# Altium schematic sheet number1.SchDoc: Number 1: DMX / RDM Tester
size A2; Date: Aug 31, 2015; DrawnBy: AF; Organization: Openlighting; DocumentName: Number1 - USD / RDM Tester
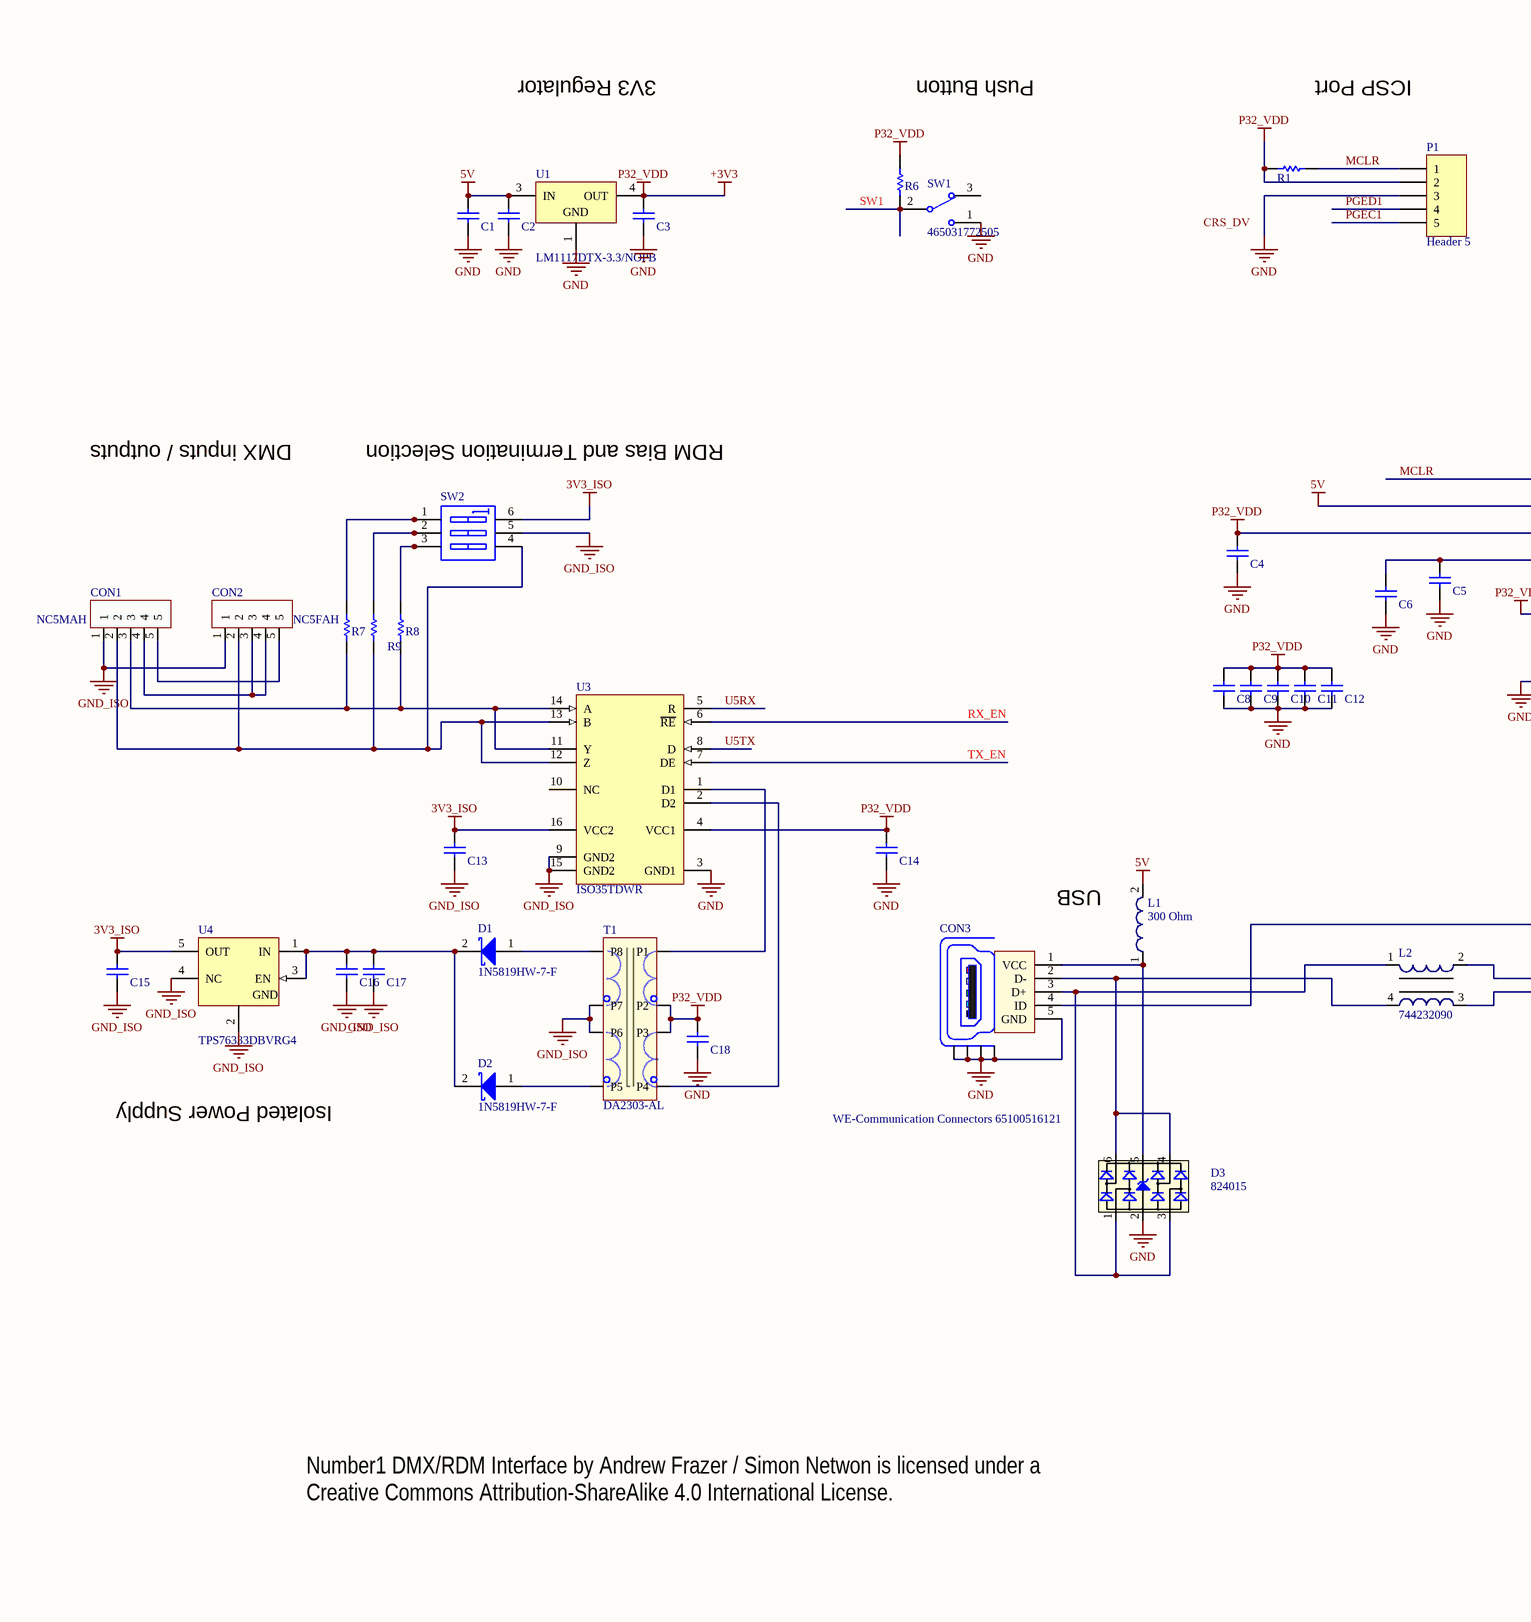
[diagram p0: number1.SchDoc, left]
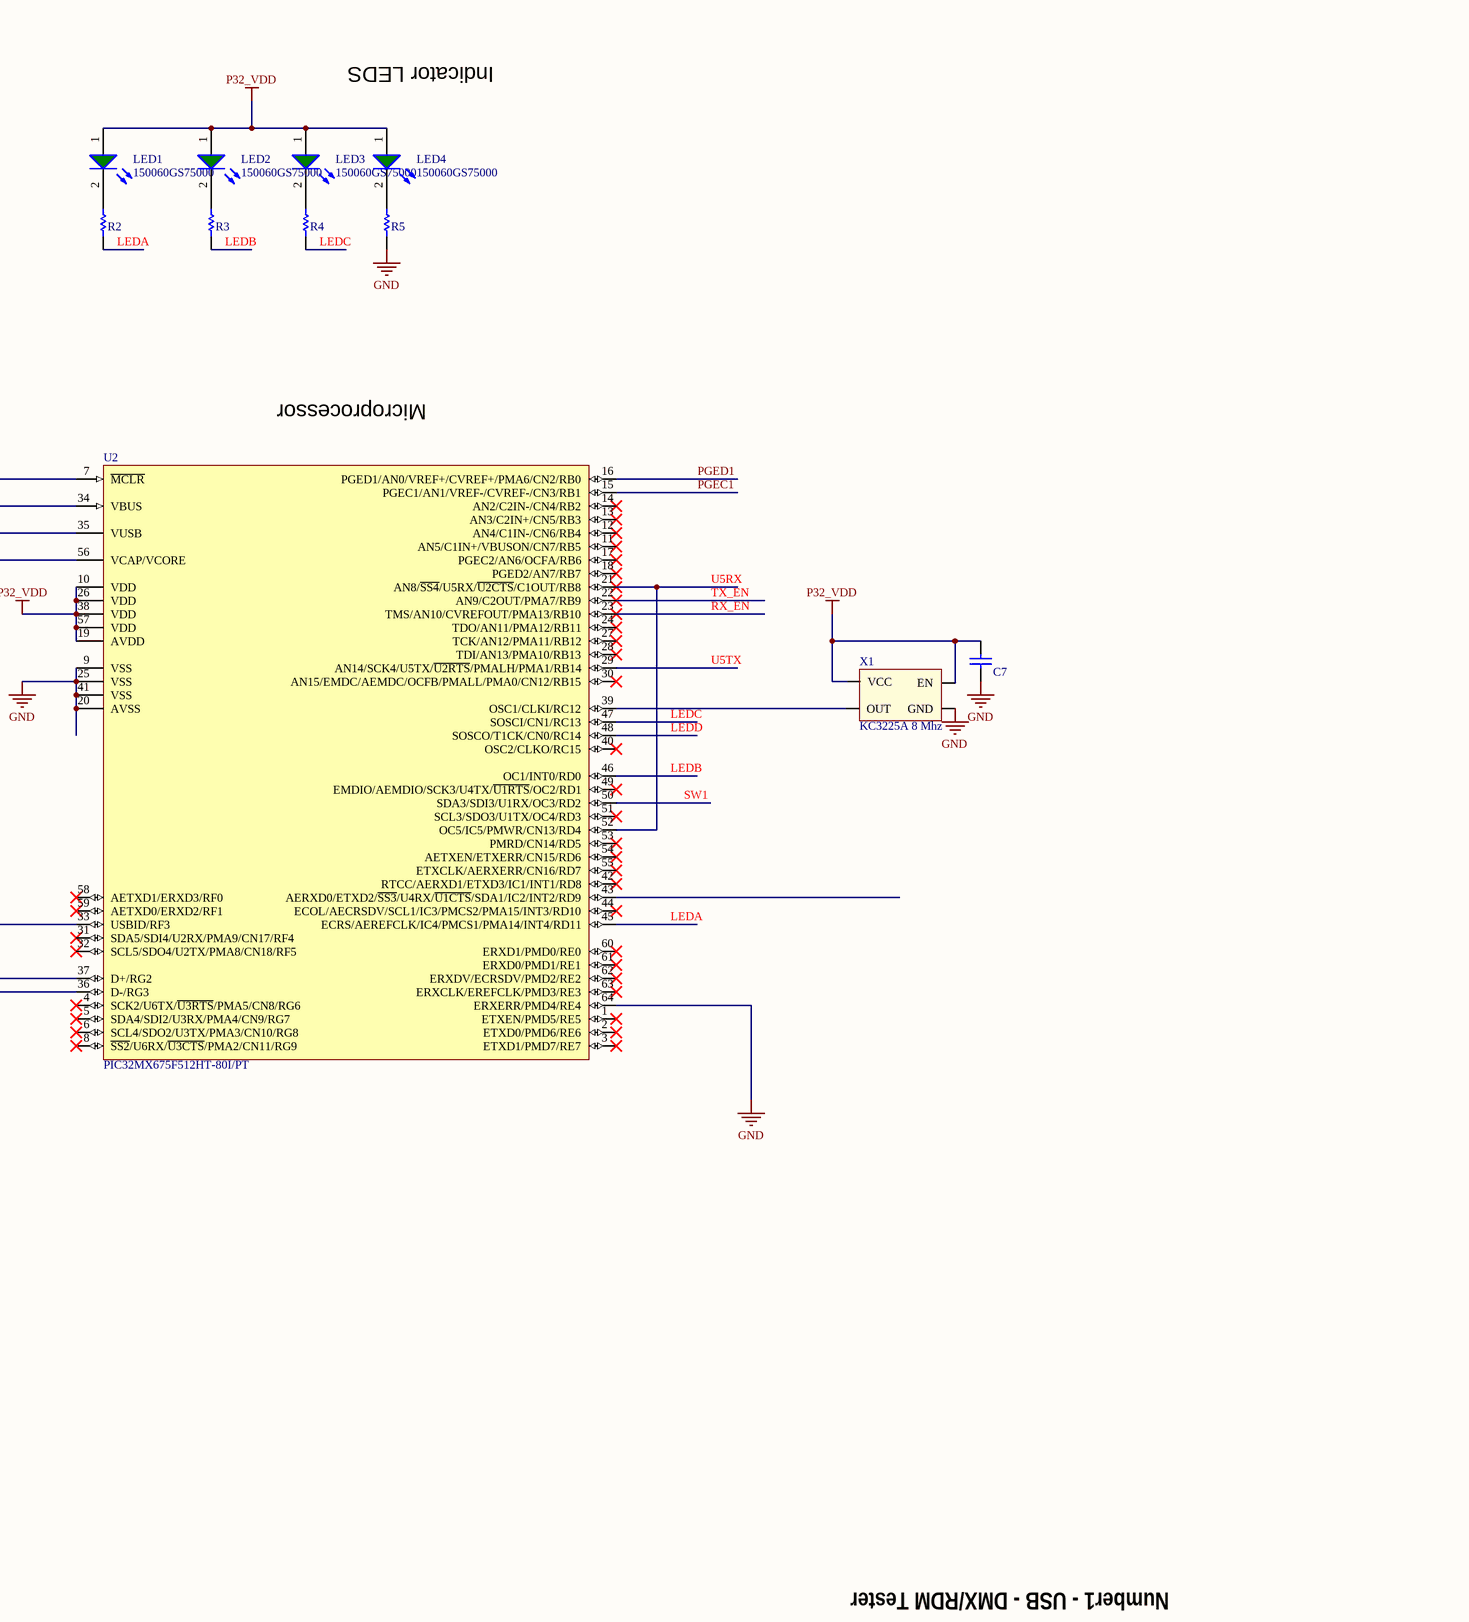
[diagram p1: number1.SchDoc, right]

## Parts
C1  CAP 10.0uF 50V 0805(2012)  [CAPC0805(2012)145_M]  (value not drawn)
C2  CAP 100nF 50V 0402(1005)  [CAPC0402(1005)60_M]  (value not drawn)
C3  CAP 100nF 50V 0402(1005)  [CAPC0402(1005)60_M]  (value not drawn)
C4  CAP 100nF 50V 0402(1005)  [CAPC0402(1005)60_M]  (value not drawn)
C5  CAP 10.0uF 50V 0805(2012)  [CAPC0805(2012)145_M]  (value not drawn)
C6  CAP 100nF 50V 0402(1005)  [CAPC0402(1005)60_M]  (value not drawn)
C7  CAP 100nF 50V 0402(1005)  [CAPC0402(1005)60_M]  (value not drawn)
C8  CAP 100nF 50V 0402(1005)  [CAPC0402(1005)60_M]  (value not drawn)
C9  CAP 100nF 50V 0402(1005)  [CAPC0402(1005)60_M]  (value not drawn)
C10  CAP 100nF 50V 0402(1005)  [CAPC0402(1005)60_M]  (value not drawn)
C11  CAP 100nF 50V 0402(1005)  [CAPC0402(1005)60_M]  (value not drawn)
C12  CAP 100nF 50V 0402(1005)  [CAPC0402(1005)60_M]  (value not drawn)
C13  CAP 100nF 50V 0402(1005)  [CAPC0402(1005)60_M]  (value not drawn)
C14  CAP 100nF 50V 0402(1005)  [CAPC0402(1005)60_M]  (value not drawn)
C15  CAP 10.0uF 50V 0805(2012)  [CAPC0805(2012)145_M]  (value not drawn)
C16  CAP 100nF 50V 0402(1005)  [CAPC0402(1005)60_M]  (value not drawn)
C17  CAP 10.0uF 50V 0805(2012)  [CAPC0805(2012)145_M]  (value not drawn)
C18  CAP 10.0uF 50V 0805(2012)  [CAPC0805(2012)145_M]  (value not drawn)
CON1  NC5MAH  [NC5MAH]
CON2  NC5FAH  [NC5FAH]
CON3  WE-Communication Connectors 65100516121  [65100516121]
D1  1N5819HW-7-F  [DIOD-SOD-123-2_V]
D2  1N5819HW-7-F  [DIOD-SOD-123-2_V]
D3  824015  [SOT23_6L]
L1  300 Ohm  [SMD 0603]
L2  744232090  [WE-CNSW, 1206]
LED1  150060GS75000  [LED_0603_Green]
LED2  150060GS75000  [LED_0603_Green]
LED3  150060GS75000  [LED_0603_Green]
LED4  150060GS75000  [LED_0603_Green]
P1  Header 5  [HDR1X5]
R1  4K7 1% 0603(1608)  [RESC0603(1608)_N]  (value not drawn)
R2  100R 1% 0603(1608)  [RESC0603(1608)_M]  (value not drawn)
R3  100R 1% 0603(1608)  [RESC0603(1608)_M]  (value not drawn)
R4  100R 1% 0603(1608)  [RESC0603(1608)_M]  (value not drawn)
R5  100R 1% 0603(1608)  [RESC0603(1608)_M]  (value not drawn)
R6  4K7 1% 0603(1608)  [RESC0603(1608)_N]  (value not drawn)
R7  560R 1% 1206(3216)  [RESC1206(3216)_N]  (value not drawn)
R8  133R 1% 1206(3216)  [RESC1206(3216)_M]  (value not drawn)
R9  560R 1% 1206(3216)  [RESC1206(3216)_N]  (value not drawn)
SW1  465031772505  [465031772505]
SW2  WE-Dip Switches WS-DITU 418217270903  [418217270903]  (value not drawn)
T1  DA2303-AL  [DA2303-AL - duplicate]
U1  LM1117DTX-3.3/NOPB  [TD03B_N]
U2  PIC32MX675F512HT-80I/PT  [TQFP-PT64_M]
U3  ISO35TDWR  [DW0016A_L]
U4  TPS76333DBVRG4  [TI-DBV5_N]
X1  KC3225A 8 Mhz  [K25-2C]

## Nets
3V3_ISO: C13.2 C15.1 SW2.6 U3.16(VCC2) U4.5(OUT)
5V: C1.1 C2.2 L1.2 U1.3(IN) U2.34(VBUS)
+3V3: C3.2 C4.2 C7.2 C8.2 C9.2 C10.2 C11.2 C12.2 C14.2 C18.1 LED1.1(A) LED2.1(A) LED3.1(A) LED4.1(A) P1.2 R1.1 R6.2 T1.2(P2) T1.3(P3) U1.4(OUT) U2.10(VDD) U2.19(AVDD) U2.26(VDD) U2.35(VUSB) U2.38(VDD) U2.57(VDD) U3.4(VCC1) X1.1(EN) X1.4(VCC)  [also labelled P32_VDD]
GND: C1.2 C2.1 C3.1 C4.1 C5.2 C6.1 C7.1 C8.1 C9.1 C10.1 C11.1 C12.1 C14.1 C18.2 CON3.5(GND) CON3.Z1(Shield) CON3.Z2(Shield) CON3.Z3(Shield) CON3.Z4(Shield) D3.2(GND) P1.3 R5.1 SW1.1 U1.1(GND) U2.9(VSS) U2.20(AVSS) U2.25(VSS) U2.41(VSS) U2.64(ERXERR/PMD4/RE4) U3.3(GND1) X1.2(GND)
GND_ISO: C13.1 C15.2 C16.1 C17.2 CON1.1 CON2.1 SW2.5 T1.6(P6) T1.7(P7) U3.9(GND2) U3.15(GND2) U4.2(GND) U4.4(NC)
LEDA: R2.1 U2.45(ECRS/AEREFCLK/IC4/PMCS1/PMA14/INT4/RD11)
LEDB: R3.1 U2.46(OC1/INT0/RD0)
LEDC: R4.1 U2.47(SOSCI/CN1/RC13)
LEDD: U2.48(SOSCO/T1CK/CN0/RC14)
MCLR: P1.1 R1.2 U2.7(~{MCLR})
PGEC1: P1.5 U2.15(PGEC1/AN1/VREF-/CVREF-/CN3/RB1)
PGED1: P1.4 U2.16(PGED1/AN0/VREF+/CVREF+/PMA6/CN2/RB0)
RX_EN: U2.23(TMS/AN10/CVREFOUT/PMA13/RB10) U3.6(~{RE})
SW1: R6.1 SW1.2 U2.50(SDA3/SDI3/U1RX/OC3/RD2)
TX_EN: U2.22(AN9/C2OUT/PMA7/RB9) U3.7(DE)
U5RX: U2.21(AN8/~{SS4}/U5RX/~{U2CTS}/C1OUT/RB8) U2.52(OC5/IC5/PMWR/CN13/RD4) U3.5(R)
U5TX: U2.29(AN14/SCK4/U5TX/~{U2RTS}/PMALH/PMA1/RB14) U3.8(D)
NetC5_1: C5.1 C6.2 U2.56(VCAP/VCORE)
NetC16_2: C16.2 C17.1 D1.2(K) D2.2(K) U4.1(IN) U4.3(EN)
NetCON1_2: CON1.2 CON2.2 R9.1 SW2.4 U3.12(Z) U3.13(B)
NetCON1_3: CON1.3 R7.1 R8.1 U3.11(Y) U3.14(A)
NetCON1_4: CON1.4 CON2.3 CON2.4
NetCON1_5: CON1.5 CON2.5
NetCON3_1: CON3.1(VCC) D3.5(VDD) L1.1
NetCON3_2: CON3.2(D-) D3.4(I/O3) D3.6(I/O4) L2.4
NetCON3_3: CON3.3(D+) D3.1(I/O1) D3.3(I/O2) L2.1
NetCON3_4: CON3.4(ID) U2.33(USBID/RF3)
NetD1_1: D1.1(A) T1.8(P8)
NetD2_1: D2.1(A) T1.5(P5)
NetL2_2: L2.2 U2.37(D+/RG2)
NetL2_3: L2.3 U2.36(D-/RG3)
NetLED1_2: LED1.2(C) R2.2
NetLED2_2: LED2.2(C) R3.2
NetLED3_2: LED3.2(C) R4.2
NetLED4_2: LED4.2(C) R5.2
NetR7_2: R7.2 SW2.1
NetR8_2: R8.2 SW2.3
NetR9_2: R9.2 SW2.2
NetT1_1: T1.1(P1) U3.1(D1)
NetT1_4: T1.4(P4) U3.2(D2)
NetU2_39: U2.39(OSC1/CLKI/RC12) X1.3(OUT)

Not connected (* = marked no-connect by the designer): SW1 3; U2 1(ETXEN/PMD5/RE5)* 2(ETXD0/PMD6/RE6)* 3(ETXD1/PMD7/RE7)* 4(SCK2/U6TX/~{U3RTS}/PMA5/CN8/RG6)* 5(SDA4/SDI2/U3RX/PMA4/CN9/RG7)* 6(SCL4/SDO2/U3TX/PMA3/CN10/RG8)* 8(~{SS2}/U6RX/~{U3CTS}/PMA2/CN11/RG9)* 11(AN5/C1IN+/VBUSON/CN7/RB5)* 12(AN4/C1IN-/CN6/RB4)* 13(AN3/C2IN+/CN5/RB3)* 14(AN2/C2IN-/CN4/RB2)* 17(PGEC2/AN6/OCFA/RB6)* 18(PGED2/AN7/RB7)* 24(TDO/AN11/PMA12/RB11)* 27(TCK/AN12/PMA11/RB12)* 28(TDI/AN13/PMA10/RB13)* 30(AN15/EMDC/AEMDC/OCFB/PMALL/PMA0/CN12/RB15)* 31(SDA5/SDI4/U2RX/PMA9/CN17/RF4)* 32(SCL5/SDO4/U2TX/PMA8/CN18/RF5)* 40(OSC2/CLKO/RC15)* 42(RTCC/AERXD1/ETXD3/IC1/INT1/RD8)* 43(AERXD0/ETXD2/~{SS3}/U4RX/~{U1CTS}/SDA1/IC2/INT2/RD9) 44(ECOL/AECRSDV/SCL1/IC3/PMCS2/PMA15/INT3/RD10)* 49(EMDIO/AEMDIO/SCK3/U4TX/~{U1RTS}/OC2/RD1)* 51(SCL3/SDO3/U1TX/OC4/RD3)* 53(PMRD/CN14/RD5)* 54(AETXEN/ETXERR/CN15/RD6)* 55(ETXCLK/AERXERR/CN16/RD7)* 58(AETXD1/ERXD3/RF0)* 59(AETXD0/ERXD2/RF1)* 60(ERXD1/PMD0/RE0)* 61(ERXD0/PMD1/RE1)* 62(ERXDV/ECRSDV/PMD2/RE2)* 63(ERXCLK/EREFCLK/PMD3/RE3)*; U3 10(NC)

## Notes on the sheet
- Indicator LEDS
- 3V3 Regulator
- Push Button
- ICSP Port
- Microprocessor
- DMX inputs / outputs
- RDM Bias and Termination Selection
- (near L1) USB
- Isolated Power Supply
- Number1 DMX/RDM Interface by Andrew Frazer / Simon Netwon is licensed under a Creative Commons Attribution-ShareAlike 4.0 International License.
- Number1 - USB - DMX/RDM Tester

## Library data of the parts
C1 C5 C15 C17 C18 = CMP-1036-04901-1: CAP 10uF 50V ±20% 0805 (2012 Metric) Thickness 1.45mm SMD; Case-Metric: 2012; Case-EIA: 0805; Value: 4.7uF; Tolerance: ±20%; Technology: SMT; Max Thickness: 1.45 mm; Rated Voltage: 50 V
C2-C4 C6-C14 C16 = CMP-1034-02077-1: CAP 100nF 50V ±10% 0402 (1005 Metric) Thickness 0.6mm SMD; Case-Metric: 1005; Case-EIA: 0402; Value: 100nF; Rated Voltage: 50 V; Technology: SMT; Tolerance: ±10%; Max Thickness: 0.6 mm
CON3 = WE-Communication Connectors 65100516121: WR-COM Mini USB SMT Type B 5 Contacts; Manufacturer: Würth Elektronik eiSos GmbH; ComponentLink1 Description: Manufacturer; ComponentLink2 Description: Datasheet; NoPins: 5; ComponentLink1URL: http://www.we-online.de; ComponentLink2URL: http://katalog.we-online.de/em/datasheet/65100516121.pdf; Created by: Karrer Zheng; Created Date: 10/10/2014; partNo: 65100516121
D1 D2 = CMP-0303-00003-1: 1.0 A Surface Mount Schottky Barrier Rectifier, 40 V, -65 to 125 degC, 2-Pin SOD-123 Package, RoHS, Tape and Reel; Manufacturer: Diodes Inc; @ VR (V): 40; @ Terminal Temperature TT (degC): 90; Maximum Average Rectified Current IO (A): 1; Total Capacitance CT (pF): 50; Peak Forward Surge Current IFSM (A): 25; Forward Voltage Drop VF (V): 0.45; VR (RMS) (V): 28; RoHS: TRUE; PartNumber: 1N5819HW-7-F; ComponentLink2URL: http://www.diodes.com/datasheets/ds30217.pdf; PackageDescription: 2-Pin SOD-123, Body 2.7 x 1.55 mm, Pitch 3.7 mm; @ IF (A): 1; Operating and Storage Temperature Range: -65 to 125 degC; ComponentLink1Description: Manufacturer URL; ComponentLink2Description: Datasheet; ComponentLink1URL: http://www.diodes.com/; Mounting Technology: Surface Mount; DatasheetVersion: Rev. 15-2; PackageReference: SOD-123-2; Maximum Reverse Current IR (uA): 50; Peak Repetitive Reverse Voltage VRRM (V): 40; Packing: Tape and Reel
D3 = WE-TVS-HS,SOT23-6L, 824015: TVS Diode WE-TVS-HS, VRWM=5V; Manufacturer: W黵th Elektronik eiSos GmbH; Reverse Stand Off Voltage: 5V; PartNo: 824015; ComponentLink1Description: Manufacturer; ComponentLink1URL: http://www.we-online.de; Created by: Christin Zierenner; Created Date: March 2010; ComponentLink2Description: Datasheet; ComponentLink2URL: http://katalog.we-online.de/kataloge/eisos/media/pdf/824015.pdf
L1 = WE-CBF 0603, 742792641: SMD EMI Suppression Ferrite Beads WE-CBF, Z= 300 Ohm; Manufacturer: Würth Elektronik eiSos GmbH; partNo: 742792641; Impedance: 300 Ohm; ComponentLink1Description: Manufacturer; ComponentLink1URL: http://www.we-online.de; Created by: Christin Zierenner; Created Date: May 2009; ComponentLink2Description: Datasheet; ComponentLink2URL: http://www.we-online.de/katalog/media/pdf/742792641.pdf
L2 = WE-CNSW 1206, 744232090: SMD Common Mode Noise Suppressor WE-CNSW,  Z= 90 Ohm; Manufacturer: Würth Elektronik eiSos GmbH; Impedance: 90 Ohm; partNo: 744232090; ComponentLink1Description: Manufacturer; ComponentLink1URL: http://www.we-online.de; Created by: Christin Zierenner; Created Date: November 2009; ComponentLink2Description: Datasheet; ComponentLink2URL: http://www.we-online.de/katalog/media/pdf/744232090.pdf
LED1-LED4 = WL-SMCW 0603  150060GS75000: SMD mono-color Chip LED, WL-SMCW, Green; Manufacturer: W黵th Elektronik eiSos GmbH; PartNo: 150060GS75000; ComponentLink1Description: Manufacturer; ComponentLink1URL: http://www.we-online.de; Created by: Christin Otto; Created Date: June 2013; ComponentLink2Description: Datasheet; ComponentLink2URL: http://katalog.we-online.com/led/datasheet/150060GS75000.pdf; Color: Green
P1 = Header 5: Header, 5-Pin; LatestRevisionDate: 17-Jul-2002; LatestRevisionNote: Re-released for DXP Platform.; Publisher: Altium Limited
R1 R6 = CMP-1012-00586-1: 4K87 0.1W 1% 0603 (1608 Metric)  SMD; Case-EIA: 0603; Case-Metric: 1608; Value: 4870.00 Ohm; Power: 0.1 W; Tolerance: 1 %; Technology: SMT
R2-R5 = CMP-1012-00397-1: 100R 0.1W 1% 0603 (1608 Metric)  SMD; Value: 100.00 Ohm; Case-EIA: 0603; Case-Metric: 1608; Technology: SMT; Tolerance: 1 %; Power: 0.1 W
R7 R9 = CMP-1014-00482-1: 560R 0.25W 1% 1206 (3216 Metric)  SMD; Case-EIA: 1206; Case-Metric: 3216; Value: 560.00 Ohm; Tolerance: 1 %; Power: 0.25 W; Technology: SMT
R8 = CMP-1014-00410-1: 133R 0.25W 1% 1206 (3216 Metric)  SMD; Case-EIA: 1206; Value: 133.00 Ohm; Case-Metric: 3216; Technology: SMT; Power: 0.25 W; Tolerance: 1 %
SW1 = WE-Push button Switches WS-PBTU 465031772505: WS-PBTU THT Push button Switch 18.5x9.8mm; Manufacturer: Wurth Elektronik; E-mail: libraries@we-online.com; ComponentLink1Description: Manufacturer; ComponentLink1URL: http://www.we-online.com; ComponentLink2Description: Datasheet; ComponentLink2URL: http://katalog.we-online.de/em/datasheet/465031772505.pdf; Created by: Karrer Zheng; Created Date: 5/11/2015; partNo: 465031772505
SW2 = WE-Dip Switches WS-DITU 418217270903: WS-DITU 2.54 mm right angled compact THT Dip Switch with raised actuator; Manufacturer: W¨¹rth Elektronik eiSos GmbH & Co.KG; ComponentLink1 Description: Manufacturer; ComponentLink2 Description: Datasheet; Creat by: Karrer Zheng; NoPins: 6; Creat Date: 13 February 2014; partNo: 418217270903; ComponentLink1URL: http://www.we-online.com; ComponentLink2URL: http://katalog.we-online.de/em/datasheet/4182172709xx.pdf
U1 = CMP-0062-00704-1: 800mA Low-Dropout Linear Regulator, 3-pin TO-252, Pb-Free; Manufacturer: National Semiconductor; PackageTopMarking: NSUZXYTT*LM1117*DT-3.3; PowerWise: N; CompType: LDO IC; DatasheetVersion: Apr-2006; PinCount: 3; RoHS: Y; PackageReference: TD03B; PackageDescription: TO252, Molded, Jedec, 6.8 x 6.10 x 2.30mm Body, 3 Lead, 2.28mm Pitch, Surface Mount; PackageVersion: revD, Feb-2009; Code_JEDEC: TO-252-AA
U2 = CMP-0048-00049-2: High Performance 80 MHz MIPS-Based 32-Bit Flash Microcontroller with USB and Ethernet, 512KB Program Memory, 64-pin TQFP, Industrial Temperature, Tape and Reel; PackageReference: TQFP-PT64; PackageDescription: 64-Lead Thin Plastic Quad Flat Pack (PT) - 10x10x1mm Body, 2.00mm [TQFP]; DatasheetVersion: revG, May-2011; ComponentLink3URL: http://www.microchip.com/; Code_JEDEC: MS-026; ComponentLink1URL: http://ww1.microchip.com/downloads/en/DeviceDoc/61156G.pdf; ComponentLink2Description: Packaging Specification; ComponentLink2URL: http://ww1.microchip.com/downloads/en/PackagingSpec/en012702.pdf; RevisionNote: Component URLs added. DatasheetVersion updated. Pin names updated.; ComponentLink1Description: Datasheet; ComponentLink3Description: Microchip.com Home; PackageVersion: revBB, Aug-2009
U3 = CMP-0328-00033-2: 1 Mbps Isolated 3 V 485 Transceiver with Integrated Transformer Driver, 3.3 V, -40 to +85 degC, 16-pin SOIC (DW), Green (RoHS & no Sb/Br); Manufacturer: Texas Instruments; Datarate(Mbps): 1; ESD(kV): 16; ICC(Max)(mA): 27; Rating: Catalog; SubFamily: Isolator; VCC(Max)(V): 3.6; Insulation Rating(VRMS): 2500; VCC(Min)(V): 3; Number of Nodes: 256; Fault Protection(V): -9 to 14; # of TX/RX: 1 TX / 1 RX; Supply Voltage(s)(V): 3.3; Duplex: Full; Isolated: Yes; TTL/CMOS Input Threshold: TTL; Fail Safe: Idle, Open, Short; ComponentLink4URL: http://www.ti.com/product/iso35t#samples; ComponentLink1Description: Manufacturer URL; MountType: SMT; PackageDescription: 16-Pin Plastic Small Outline, Body 10.30 x 7.50 mm, Pitch 1.27 mm; DatasheetVersion: SLLSE26C; ComponentLink1URL: http://www.ti.com/; ComponentLink3Description: Package Specification; PartNumber: ISO35TDWR; PackageVersion: 4040000-2/G, 01/2011; ComponentLink4Description: SamplesURL; ComponentLink3URL: http://www.ti.com/litv/pdf/msoi003g; PackageReference: DW0016A; ComponentLink2Description: Datasheet; ComponentLink2URL: http://www.ti.com/general/docs/lit/getliterature.tsp?genericPartNumber=ISO35T&fileType=pdf; Code_JEDEC: MS-013; Thermal Shutdown: Yes
U4 = CMP-0394-00568-1: Single Output LDO, 150 mA, Fixed 3.3 V Output, 2.7 to 10 V Input, with Low IQ, 5-pin SOT-23 (DBV), -40 to 125 degC, Green (RoHS & no Sb/Br); Manufacturer: Texas Instruments; Vout Adj(Max)(V): 3.3; Vin(Min)(V): 2.7; Vdo(Typ)(mV): 300; Accuracy(%): 3; Iq(Typ)(mA): 0.08; SubFamily: Single Channel LDO; Vin(Max)(V): 10; Iout(Max)(A): 0.15; DatasheetVersion: SLVS181H; ComponentLink1URL: http://www.ti.com/; Eco-Plan: Green (RoHS & no Sb/Br); PartNumber: TPS76333DBVRG4; PackageDescription: 5-Pin Plastic Small Outline, Body 1.60 Ã— 2.90 mm, Pitch 0.95 mm; ComponentLink1Description: Manufacturer URL; PackageVersion: 4073253-4/K; ComponentLink3URL: http://www.ti.com/litv/pdf/mpds018i; ComponentLink2URL: http://www.ti.com/general/docs/lit/getliterature.tsp?genericPartNumber=TPS76333&fileType=pdf; Fixed Output Options(V): 3.3; Vout Adj(Min)(V): 3.3; ComponentLink3Description: Package Specification; Mounting Technology: Surface Mount; Code_JEDEC: MO-178; ComponentLink2Description: Datasheet; PackageReference: DBV5
X1 = KC3225A 50.000Mhz: 8Mhz Xtal